# EAGLE design AmeshLight_BLE (EAGLE 6.5.0)
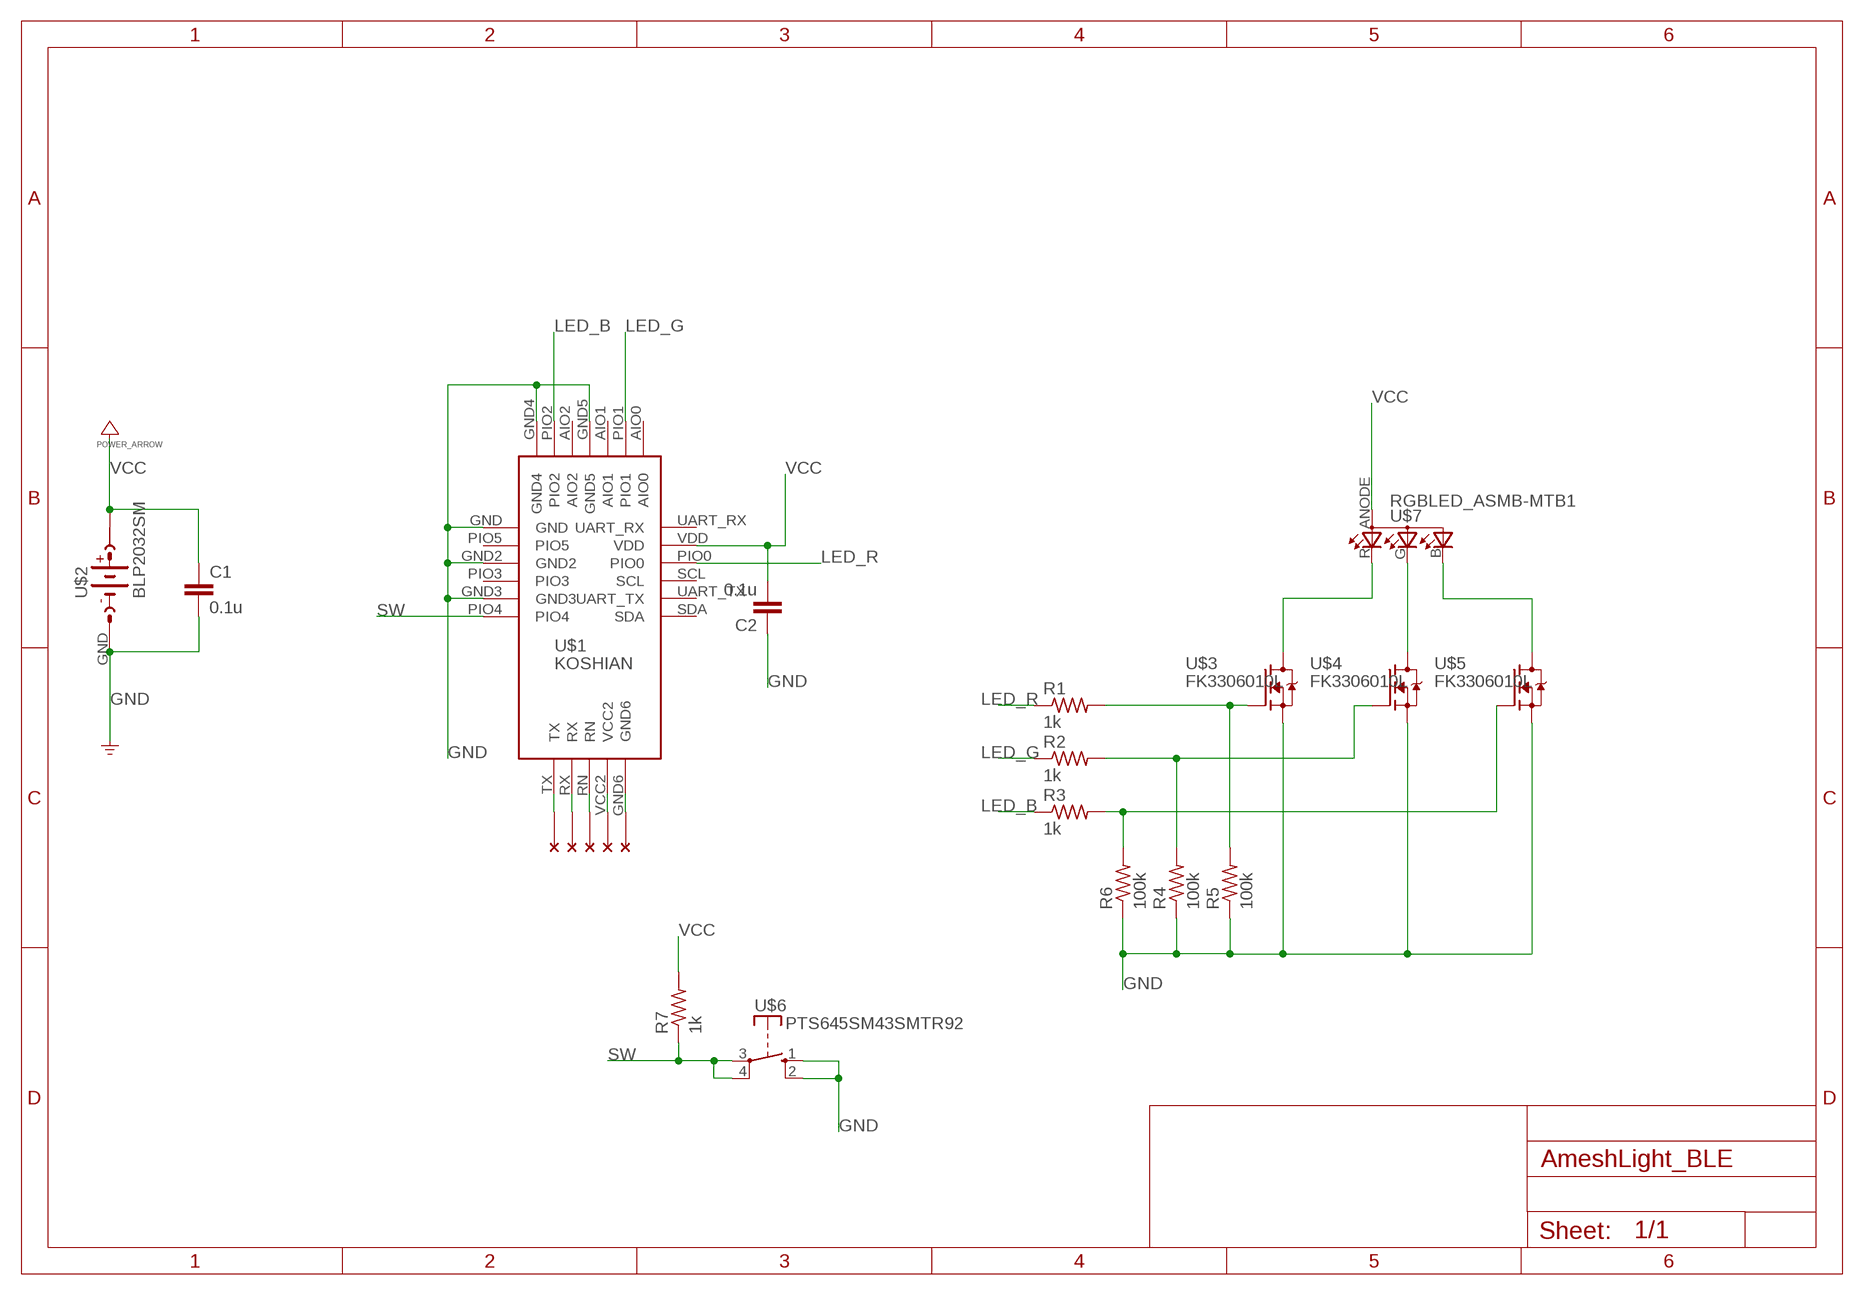
[diagram p0: schematic, sheet 1]

## Parts
C1  0.1u  C-EUC0603  [C0603]
C2  0.1u  C-EUC0603  [C0603]
R1  1k  R-US_R0603  [R0603]
R2  1k  R-US_R0603  [R0603]
R3  1k  R-US_R0603  [R0603]
R4  100k  R-US_R0603  [R0603]
R5  100k  R-US_R0603  [R0603]
R6  100k  R-US_R0603  [R0603]
R7  1k  R-US_R0603  [R0603]
U$1  KOSHIAN  [KOSHIAN]
U$2  BLP2032SM  [BLP2032SM]
U$3  FK3306010L  [FK3306010L]
U$4  FK3306010L  [FK3306010L]
U$5  FK3306010L  [FK3306010L]
U$6  PTS645SM43SMTR92  [PTS645SM43SMTR92]
U$7  RGBLED_ASMB-MTB1  [RGBLED_ASMB-MTB1]
U$8  NC  (no package)
U$9  NC  (no package)
U$10  NC  (no package)
U$11  NC  (no package)
U$12  NC  (no package)

## Nets
GND: C1.2 C2.1 R4.1 R5.1 R6.1 U$1.GND U$1.GND2 U$1.GND3 U$1.GND4 U$1.GND5 U$2.GND U$3.S U$4.S U$5.S U$6.1(S) U$6.2
LED_B: R3.1 U$1.PIO2
LED_G: R2.1 U$1.PIO1
LED_R: R1.1 U$1.PIO0
N$1: U$1.TX U$8.P$1
N$2: U$3.D U$7.R(1RED)
N$3: U$4.D U$7.G(2GREEN)
N$4: U$5.D U$7.B(3BLUE)
N$5: R3.2 R6.2 U$5.G
N$6: U$1.RX U$9.P$1
N$7: R1.2 R5.2 U$3.G
N$8: U$1.RN U$10.P$1
N$9: U$1.VCC2 U$11.P$1
N$10: R2.2 R4.2 U$4.G
N$11: U$1.GND6 U$12.P$1
SW: R7.1 U$1.PIO4 U$6.3 U$6.4
VCC: C1.1 C2.2 R7.2 U$1.VDD U$2.VCC U$7.ANODE ; supply symbol labelled POWER_ARROW
Unconnected: U$1.AIO0 U$1.AIO1 U$1.AIO2 U$1.PIO3 U$1.PIO5 U$1.SCL U$1.SDA U$1.UART_RX U$1.UART_TX

## Library data of the parts
C1 C2 = rcl:C-EU: CAPACITOR, European symbol
R1-R7 = rcl:R-US_: RESISTOR, American symbol
U$1 = okada2017:KOSHIAN
U$2 = okada2017:BLP2032SM
U$3-U$5 = okada2017:FK3306010L
U$6 = okada2017:PTS645SM43SMTR92
U$7 = okada2017:RGBLED_ASMB-MTB1
U$8-U$12 = okada2017:NC; _EXTERNAL_: _EXTERNAL_

## Board
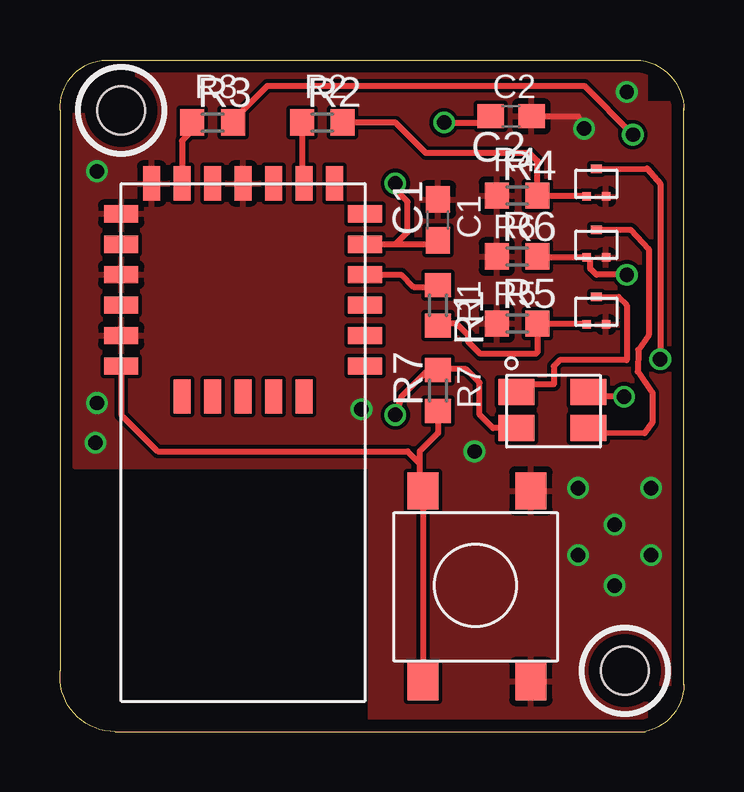
[diagram p1: board, top side]
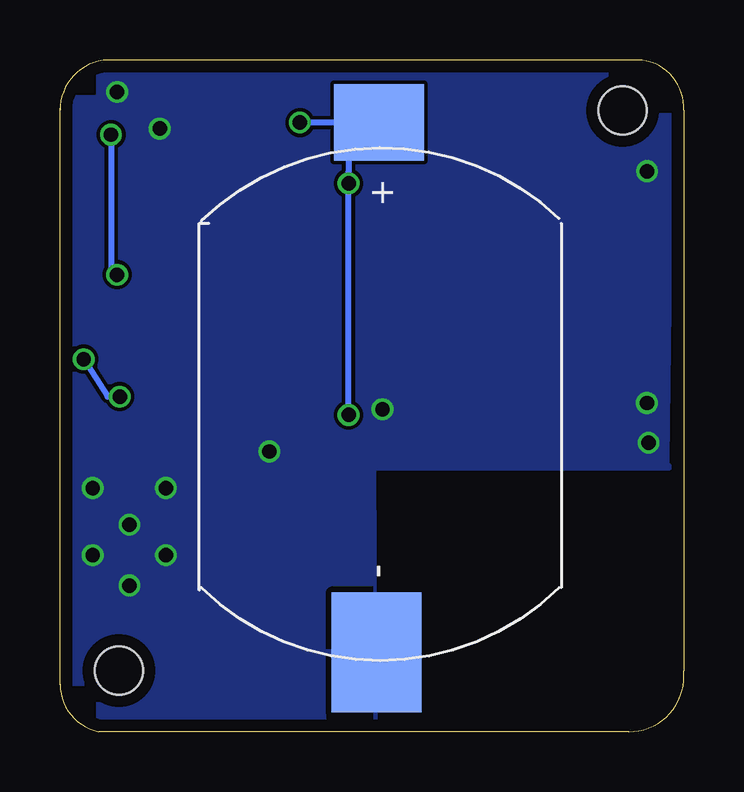
[diagram p2: board, bottom side, seen from below]

Size 26.02 x 28.01 mm. Coordinates in mm from the lower left corner, seen from the top.
Outline: 26.02,26 26.02,25.91 arc94 23.82,28 2.11,28 arc97 0.01,25.91 0.01,2.54 arc96 2.3,0 24.4,0 arc77 26.02,1.97
Outline: 26.01,25.9 26.01,1.96 26.02,1.96
Copper layers (1*16): Top 0.035mm / dielectric 1.6mm / Bottom 0.035mm
Design rules "Elecrow_2-layer_PCB_eagle_rule": minimum track width 6mil, minimum drill 12mil, track to track 6mil, track to pad 6mil, pad to pad 6mil, via to via 8mil, smd to smd 0mil, copper to edge 20mil, drill to drill 10mil, minimum pad ring 6mil, minimum via ring 6mil, stop-mask expansion 0mil, vias tented up to drill 100mil, thermal gap 10mil
Holes 2 mm at 23.55,2.54 2.55,25.91

### Footprints (pad centres in the part's own frame; a part is rotated, then mirrored left to right if it is on the bottom)
C0603 = smd 1.1 x 1: 1 -0.85,0; 2 0.85,0
R0603 = smd 1 x 1.1: 1 -0.85,0; 2 0.85,0
KOSHIAN = smd 0.711 x 1.422: AIO0 3.81,6.35; AIO1 1.27,6.35; AIO2 -1.27,6.35; GND4 -3.81,6.35; GND5 0,6.35; GND6 2.54,-2.54; PIO1 2.54,6.35; PIO2 -2.54,6.35; RN 0,-2.54; RX -1.27,-2.54; TX -2.54,-2.54; VCC2 1.27,-2.54 | smd 1.422 x 0.711: GND -5.08,5.08; GND2 -5.08,2.54; GND3 -5.08,0; PIO0 5.08,2.54; PIO3 -5.08,1.27; PIO4 -5.08,-1.27; PIO5 -5.08,3.81; SCL 5.08,1.27; SDA 5.08,-1.27; UART_RX 5.08,5.08; UART_TX 5.08,0; VDD 5.08,3.81
BLP2032SM = smd 5 x 3.75: GND 22.1,-0.1 | smd 3.2 x 3.75: VCC 0,0
FK3306010L = smd 0.45 x 0.35: D 0,0.35 | smd 0.35 x 0.35: G -0.4,-0.8; S 0.4,-0.8
PTS645SM43SMTR92 = smd 1.55 x 1.3: 1 -1,1; 2 6.95,1; 3 -1,-3.5; 4 6.95,-3.5
RGBLED_ASMB-MTB1 = smd 1.1 x 1.5: ANODE 0.8,-0.8; B 0.8,2.2; G -0.7,2.2; R -0.7,-0.8

### Placement (x,y rotation side)
C1  15.76,21.34 90 top
C2  18.81,25.65 180 top
R1  15.76,17.78 270 top
R2  10.94,25.4 0 top
R3  6.36,25.4 0 top
R4  19.06,22.35 0 top
R5  19.06,17.02 0 top
R6  19.06,19.81 0 top
R7  15.76,14.22 90 top
U$1  7.63,16.51 0 top
U$2  12.71,25.4 270 bottom
U$3  22.37,17.78 0 top
U$4  22.37,23.11 0 top
U$5  22.37,20.57 0 top
U$6  18.64,9.04 270 top
U$7  19.83,13.46 270 top

### Tracks (layer width: path | path; a pad name or v marks a point on that pad's centre or on a via)
GND  (via drill 0.6)
  Top 0.254: C2.1 21.6,25.65 v21.86,25.15
  Bottom 0.406: U$2.GND 13.98,3.3 11.95,3.3
  other vias: 1.55,13.7 1.48,12.05 12.57,13.44 23.13,6.1 21.6,7.37 23.13,8.64 21.6,10.16 1.54,23.37 23.64,26.67 24.65,7.37 24.65,10.16 17.29,11.68
  pour Top: 2.55,27.43 2.55,25.65 0.52,25.65 0.52,23.37 0.59,11.09 12.94,11.09 12.94,0.32 24.4,0.51 24.4,2.03 25.92,2.03 25.92,26.16 24.4,26.16 24.4,27.69 4.33,27.43
  pour Bottom: 0.52,25.65 2.81,25.65 2.81,27.69 24.4,27.69 24.4,26.42 25.67,26.42 25.67,2.03 24.4,2.03 24.4,0.51 13.26,0.51 12.88,0.38 12.94,11.02 0.59,11.02 0.78,11.21 0.97,11.28 0.71,11.28
LED_B
  Top 0.254: R3.1 5.51,25.06 5.09,24.64 U$1.PIO2
LED_G
  Top 0.254: R2.1 10.09,22.95 U$1.PIO1
LED_R
  Top 0.254: U$1.PIO0 14.24,19.05 14.75,18.54 15.67,18.54 R1.1
N$2
  Top 0.254: U$3.D 23.29,18.13 23.64,17.78 23.64,15.49 20.84,15.49 20.59,15.24 20.59,14.48 19.34,14.48 U$7.R
N$3  (via drill 0.6)
  Top 0.254: U$4.D 24.49,23.48 25.03,22.85 v25.03,15.53 | v23.53,13.97 22.22,13.97 U$7.G
  Bottom 0.254: v25.03,15.53 24.03,13.97 v23.53,13.97
N$4
  Top 0.254: U$5.D 23.79,20.92 24.55,20.13 24.55,16.54 24.11,15.92 24.09,15.01 24.71,14.13 24.71,12.89 24.37,12.44 22.24,12.45 U$7.B
N$5  (via drill 0.6)
  Top 0.254: R3.2 7.21,25.49 8.65,26.92 21.86,26.92 v23.89,24.89 | v23.64,19.05 22.37,19.05 22.11,19.3 22.11,19.63 U$5.G 19.95,19.77 R6.2
  Bottom 0.254: v23.89,24.89 23.89,19.3 v23.64,19.05
N$7
  Top 0.254: U$3.G 21.93,17.02 R5.2 19.91,15.84 19.83,15.75 17.54,15.75 17.03,16.26 17.03,16.51 16.52,17.02 15.85,17.02 R1.2
N$10
  Top 0.254: U$4.G 21.93,22.35 R4.2 19.91,23.79 19.57,24.13 15.25,24.13 13.98,25.4 R2.2
SW
  Top 0.254: R7.1 15.76,12.45 15,11.68 15,11.18 | 15,11.18 15,10.18 U$6.3 U$6.4 | U$1.PIO4 2.55,13.21 4.08,11.68 14.49,11.68 15,11.18
VCC  (via drill 0.6)
  Top 0.254: C1.1 15.6,20.32 U$1.VDD 13.98,20.32 14.49,20.83 14.49,22.1 13.98,22.61 v13.98,22.86 | v16.02,25.4 17.71,25.4 C2.2 | v13.98,13.21 14.24,13.97 15.34,15.07 R7.2 16,15.12 16.93,15.12 17.5,14.55 17.5,13.22 18.06,12.66 U$7.ANODE
  Bottom 0.254: v13.98,22.86 13.98,23.37 | 13.22,25.4 13.98,24.64 v13.98,22.86 | 13.22,25.4 v16.02,25.4 | v13.98,13.21 v13.98,22.86 | U$2.VCC 13.22,25.4

### Text on the board
tPlace: R3 | R2 | C2 | R4 | C1 | R6 | R5 | R1 | R7